# Altium schematic sheet 5V-12Visolated.SchDoc
size A
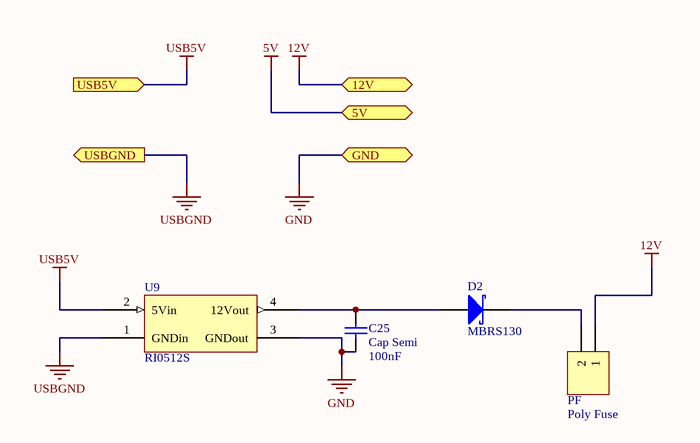
[diagram p0: 5V-12Visolated.SchDoc]

## Parts
C25  Cap Semi  value 100nF  [0603]
D2  MBRS130  [SMB]
PF  Poly Fuse  [HDR1X2]
U9  RI0512S  [DIP8]

## Ports
5V, 12V, GND, USB5V (in), USBGND (out)

## Nets
5V: port 5V
12V: PF.1 ; port 12V
GND: C25.2 U9.3(GNDout) ; port GND
USB5V: U9.2(5Vin) ; port USB5V
USBGND: U9.1(GNDin) ; port USBGND
NetC25_1: C25.1 D2.A U9.4(12Vout)
NetD2_K: D2.K PF.2

## Library data of the parts
C25 = Cap Semi: Capacitor (Semiconductor SIM Model); Published: 8-Jun-2000; LatestRevisionDate: 17-Jul-2002; LatestRevisionNote: Re-released for DXP Platform.; PackageReference: C1206; Publisher: Altium Limited; Element14: 9406140; Element14 Price: 0.13
D2 = D SCHOTTKY: Schottky Diode; Revision: July-2002: Re-released for DXP Platform.; Element14: 9556931; Element14 Price: 0.43; Digikey: MBRS130LT3GOSCT-ND; Digikey Price: 0.311
PF = Header 2: Header, 2-Pin; LatestRevisionDate: 17-Jul-2002; LatestRevisionNote: Re-released for DXP Platform.; Publisher: Altium Limited
U9 = RI0512S: 5V-12V isolated; Element14 (low stock): 1793280; Element14 Price: 10.58; Digikey: 945-1190-ND; Digikey Price: 6.67